# EAGLE design FoamBot Arduino Pololu servo r1 (EAGLE 6.5.0)
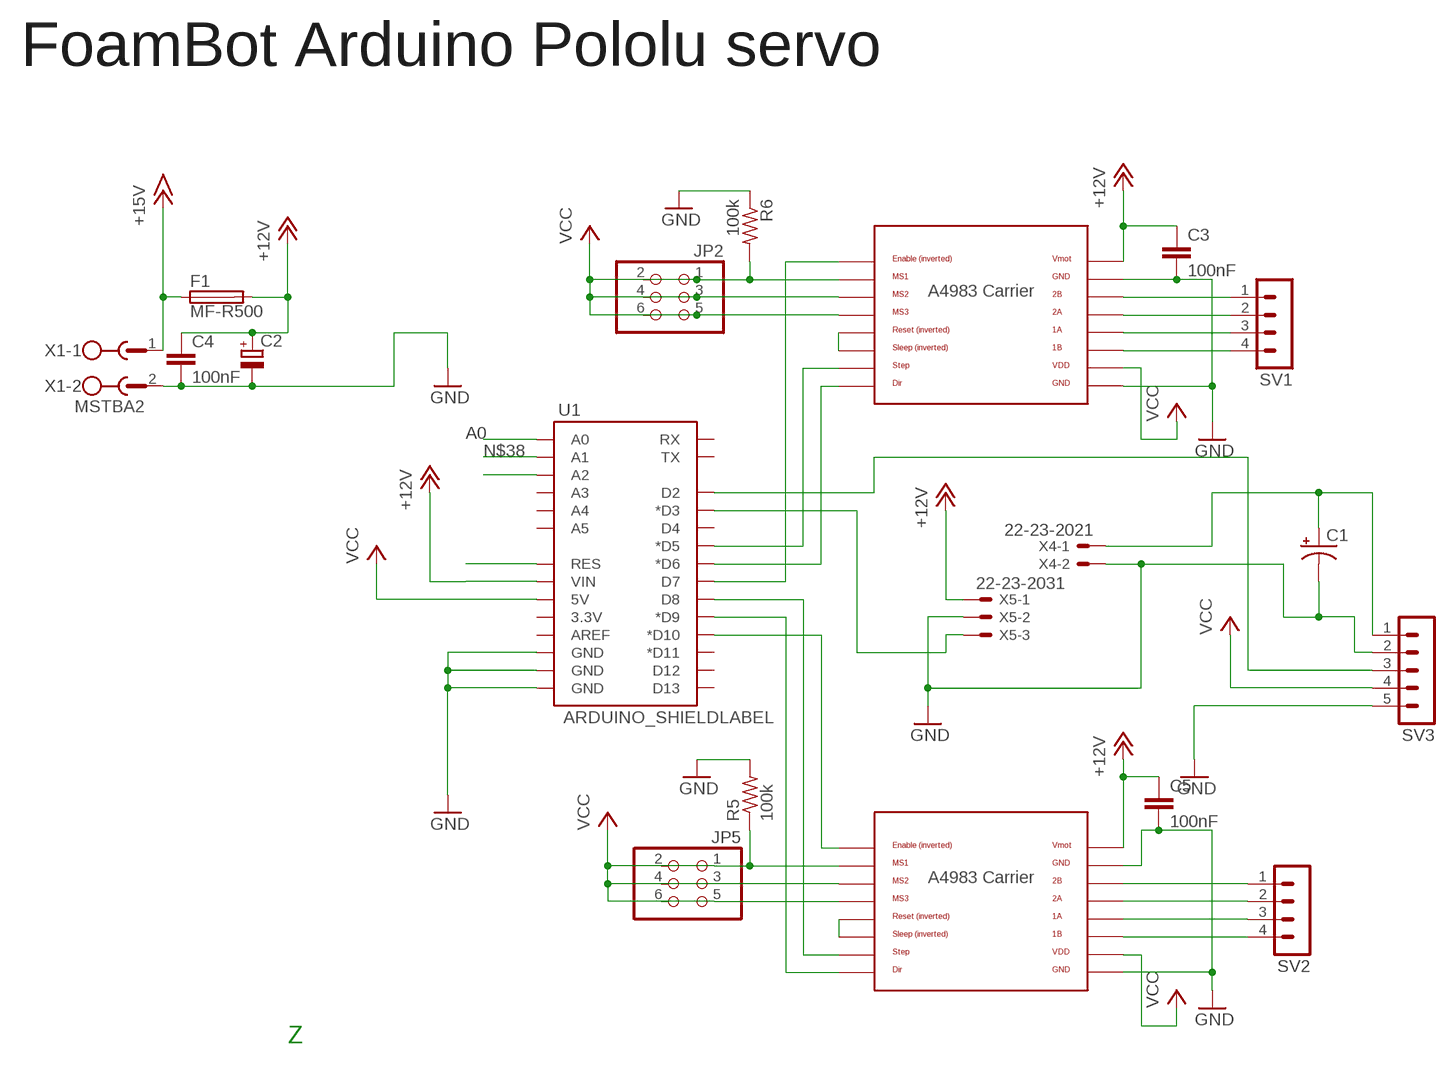
[diagram p0: schematic, sheet 1]

## Parts
C1  CPOL-USE5-10.5  [E5-10,5]
C2  CPOL-EUE7.5-16  [E7,5-16]
C3  100nF  C2,5-3  [C2.5-3]
C4  100nF  C2,5-3  [C2.5-3]
C5  100nF  C2,5-3  [C2.5-3]
F1  MF-R500  LITTLEFUSE  [LITTLEFUSE]
JP2  PINHD-2X3  [2X03]
JP5  PINHD-2X3  [2X03]
R5  100k  R-US_0207/7  [0207/7]
R6  100k  R-US_0207/7  [0207/7]
SV1  MA04-1  [MA04-1]
SV2  MA04-1  [MA04-1]
SV3  MA05-1  [MA05-1]
U1  ARDUINO_SHIELDLABEL  [DUEMILANOVE_SHIELD]
U2  POLOLU_A4983CARRIER  [A4983CARRIER]
U3  POLOLU_A4983CARRIER  [A4983CARRIER]
X1  MSTBA2  [MSTBA2]
X4  22-23-2021  [22-23-2021]
X5  22-23-2031  [22-23-2031]

## Nets
+12V: C2.+ C3.1 C4.1 C5.1 F1.2 U1.VIN U2.VMOT U3.VMOT X5.1
+15V: F1.1 X1.1
A0: U1.A0
GND: C1.- C2.- C3.2 C4.2 C5.2 R5.2 R6.1 SV3.2 SV3.5 U1.GND@0(GND) U1.GND@1(GND) U1.GND@2(GND) U2.GND U2.GND@0(GND) U3.GND U3.GND@0(GND) X1.2 X4.2 X5.2
N$1: U1.D5(*D5) U2.STEP
N$2: U1.D6(*D6) U2.DIR
N$3: SV1.1 U2.2B
N$4: SV1.2 U2.2A
N$8: U2.RST U2.SLP(SLEEP)
N$10: SV1.3 U2.1A
N$11: SV1.4 U2.1B
N$12: SV2.4 U3.1B
N$13: U1.D7 U2.EN
N$16: U1.D8 U3.STEP
N$17: U1.D9(*D9) U3.DIR
N$20: U3.RST U3.SLP(SLEEP)
N$21: SV2.1 U3.2B
N$22: SV2.2 U3.2A
N$23: U1.D10(*D10) U3.EN
N$24: U1.D3(*D3) X5.3
N$25: SV3.3 U1.D2
N$26: SV2.3 U3.1A
N$28: C1.+ SV3.1 X4.1
N$38: U1.A1
N$39: U1.A2
RESET: U1.RES
VCC: JP2.1 JP2.2 JP2.3 JP2.4 JP2.5 JP2.6 JP5.1 JP5.2 JP5.3 JP5.4 JP5.5 JP5.6 R5.1 R6.2 SV3.4 U1.5V U2.MS1 U2.MS2 U2.MS3 U2.VDD U3.MS1 U3.MS2 U3.MS3 U3.VDD
Unconnected: U1.3.3V U1.A3 U1.A4 U1.A5 U1.AREF U1.D4 U1.D11(*D11) U1.D12 U1.D13 U1.RX U1.TX

## Notes on the sheet
- FoamBot Arduino Pololu servo
- Z

## Library data of the parts
C1 = resistor:CPOL-US: POLARIZED CAPACITOR, American symbol
C2 = rcl:CPOL-EU: POLARIZED CAPACITOR, European symbol
C3-C5 = capacitor-wima:C: CAPACITOR naming: grid - package width
F1 = fuse:LITTLEFUSE: LITTLEFUSE Picofuse/slow Littlefuse; OC_FARNELL: unknown; OC_NEWARK: unknown
JP2 JP5 = pinhead:PINHD-2X3: PIN HEADER
R5 R6 = adafruit:R-US_: RESISTOR, American symbol
SV1 SV2 = con-lstb:MA04-1: PIN HEADER; OC_FARNELL: unknown; OC_NEWARK: unknown
SV3 = con-lstb:MA05-1: PIN HEADER; OC_FARNELL: unknown; OC_NEWARK: unknown
U1 = SparkFun-Boards:ARDUINO_SHIELD: Arduino shield footprint
U2 U3 = ultimachine:POLOLU_A4983CARRIER
X1 = con-phoenix-508:MSTBA2: PHOENIX; MF: FARNELL; MPN: 1757242; OC_FARNELL: 3705171; OC_NEWARK: 71C4161
X4 = con-molex:22-23-2021: .100" (2.54mm) Center Header - 2 Pin; MF: MOLEX; MPN: 22-23-2021; OC_FARNELL: 1462926; OC_NEWARK: 25C3832
X5 = con-molex:22-23-2031: .100" (2.54mm) Center Header - 3 Pin; MF: MOLEX; MPN: 22-23-2031; OC_FARNELL: 1462950; OC_NEWARK: 30C0862

## Board
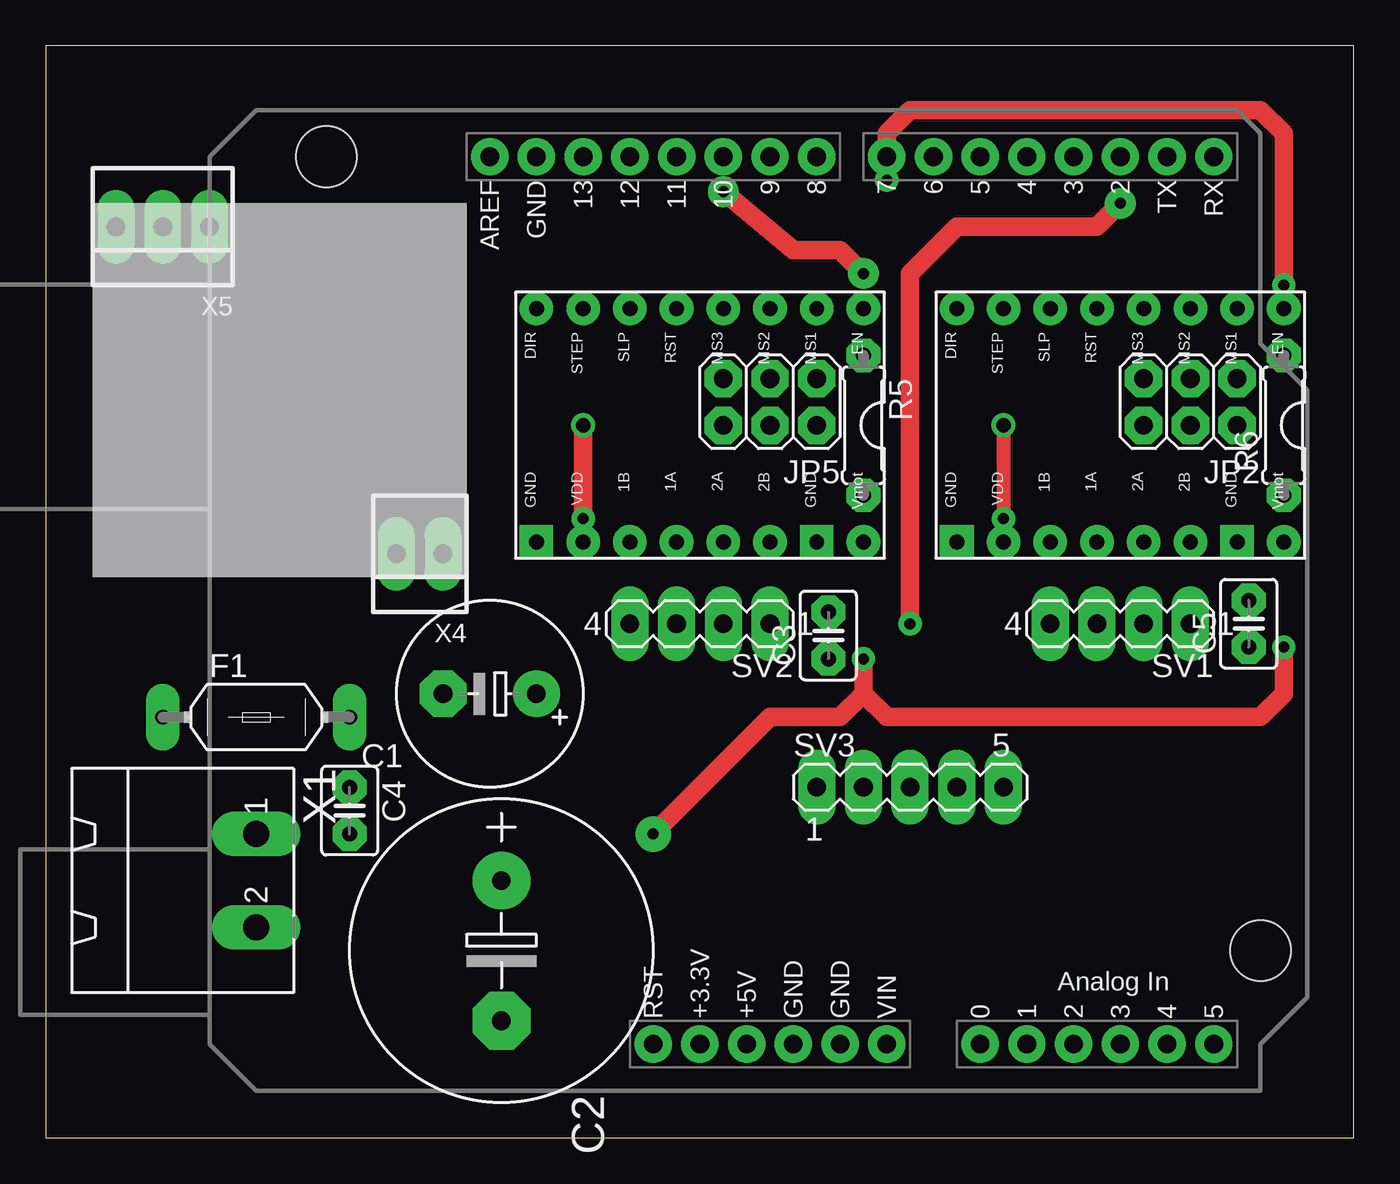
[diagram p1: board, top side]
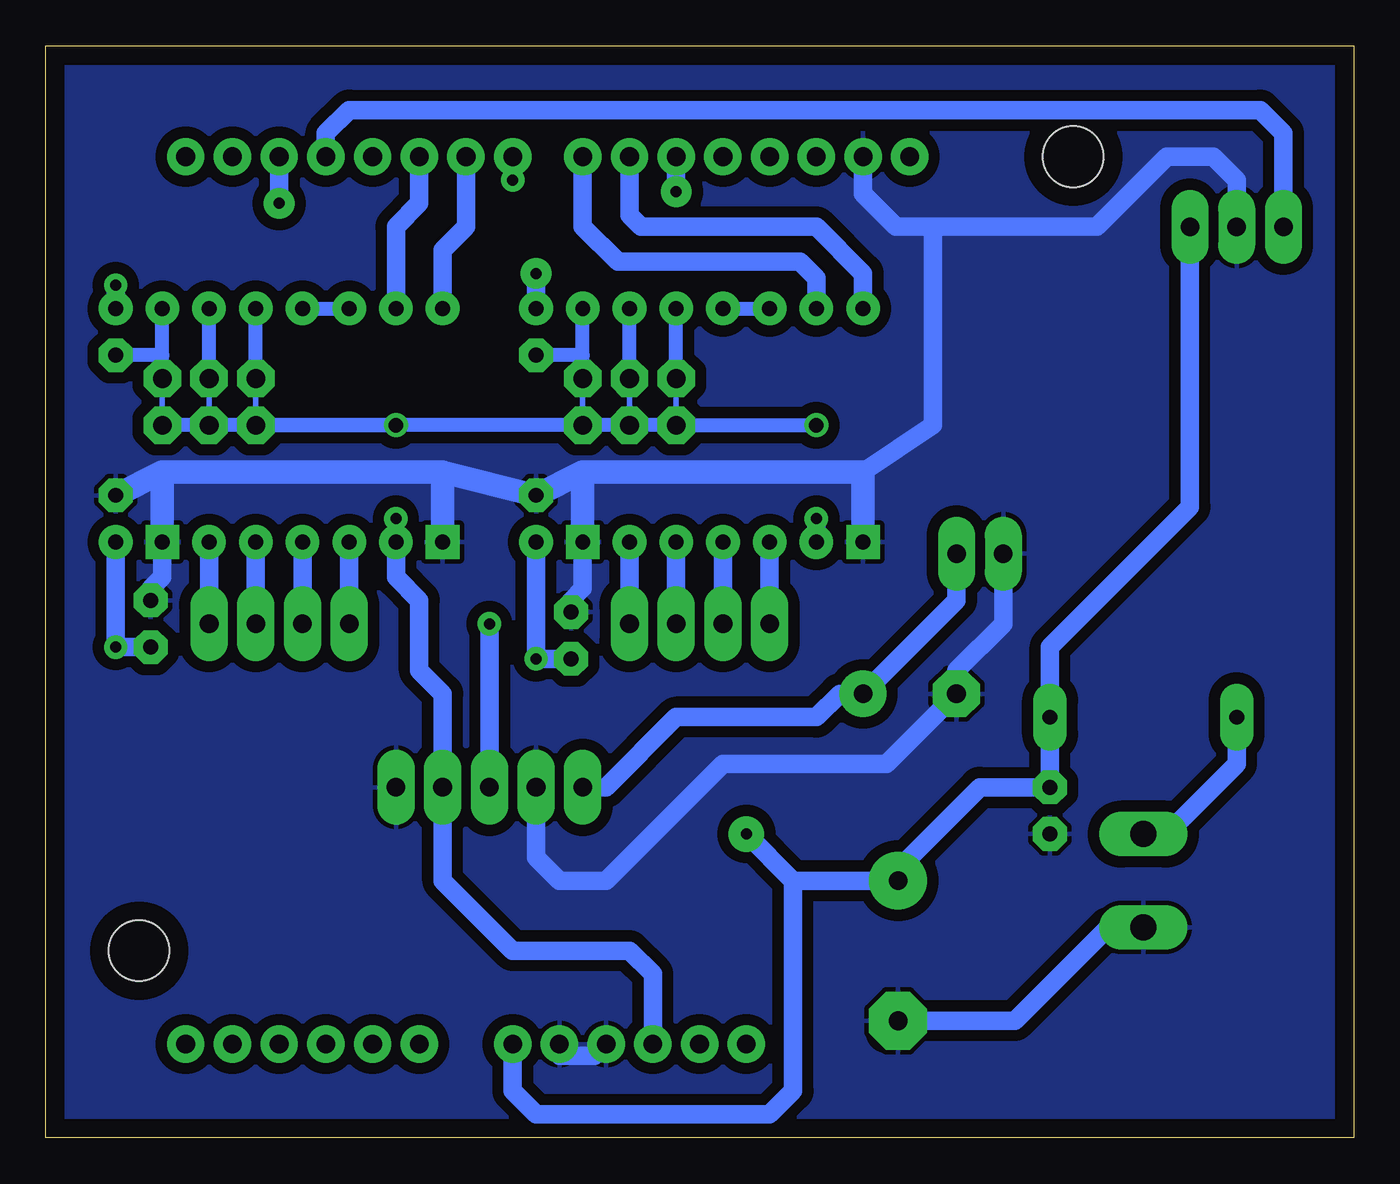
[diagram p2: board, bottom side, seen from below]

Size 71.1 x 59.36 mm. Coordinates in mm from the lower left corner, seen from the top.
Outline: 0,0 71.1,0 71.1,59.36 0,59.36 0,0
Copper layers (1*16): Top 0.035mm / dielectric 1.5mm / Bottom 0.035mm
Design rules "default *": minimum track width 30mil, minimum drill 30mil, track to track 8mil, track to pad 8mil, pad to pad 8mil, via to via 8mil, smd to smd 8mil, copper to edge 40mil, drill to drill 8mil, minimum pad ring 20mil, minimum via ring 10mil, stop-mask expansion 4mil, vias tented up to drill 0mil, thermal gap 10mil

### Footprints (pad centres in the part's own frame; a part is rotated, then mirrored left to right if it is on the bottom)
E5-10,5 = drill 1.016 pad 2.54: + -2.54,0 | drill 1.016 pad 2.54 octagon: - 2.54,0
E7,5-16 = drill 1.016 pad 3.15: + -3.81,0 | drill 1.016 pad 3.15 octagon: - 3.81,0
C2.5-3 = drill 0.813 pad 1.6 octagon: 1 -1.27,0; 2 1.27,0
LITTLEFUSE = drill 0.813 pad 1.778 long: 1 -5.08,0; 2 5.08,0
2X03 = drill 1.016 octagon: 1 -2.54,-1.27; 2 -2.54,1.27; 3 0,-1.27; 4 0,1.27; 5 2.54,-1.27; 6 2.54,1.27
0207/7 = drill 0.813 octagon: 1 -3.81,0; 2 3.81,0
MA04-1 = drill 1.016 long: 1 -3.81,0; 2 -1.27,0; 3 1.27,0; 4 3.81,0
MA05-1 = drill 1.016 long: 1 -5.08,0; 2 -2.54,0; 3 0,0; 4 2.54,0; 5 5.08,0
DUEMILANOVE_SHIELD = drill 1.016 pad 1.88: 3.3V 50.8,26.67; 5V 50.8,29.21; A0 50.8,41.91; A1 50.8,44.45; A2 50.8,46.99; A3 50.8,49.53; A4 50.8,52.07; A5 50.8,54.61; AREF 2.54,15.24; D2 2.54,49.53; D3 2.54,46.99; D4 2.54,44.45; D5 2.54,41.91; D6 2.54,39.37; D7 2.54,36.83; D8 2.54,33.02; D9 2.54,30.48; D10 2.54,27.94; D11 2.54,25.4; D12 2.54,22.86; D13 2.54,20.32; GND@0 50.8,31.75; GND@1 50.8,34.29; GND@2 2.54,17.78; RES 50.8,24.13; RX 2.54,54.61; TX 2.54,52.07; VIN 50.8,36.83 | hole 3.302: 45.72,57.15; 2.54,6.35
A4983CARRIER = drill 0.813: 1A 8.89,1.27; 1B 11.43,1.27; 2A 6.35,1.27; 2B 3.81,1.27; DIR 16.51,-11.43; EN -1.27,-11.43; MS1 1.27,-11.43; MS2 3.81,-11.43; MS3 6.35,-11.43; RST 8.89,-11.43; SLP 11.43,-11.43; STEP 13.97,-11.43; VDD 13.97,1.27; VMOT -1.27,1.27 | drill 0.813 square: GND 16.51,1.27; GND@0 1.27,1.27
MSTBA2 = drill 1.397 long: 1 -2.54,5.08; 2 2.54,5.08
22-23-2021 = drill 1 long: 1 -1.27,0; 2 1.27,0
22-23-2031 = drill 1 long: 1 -2.54,0; 2 0,0; 3 2.54,0

### Placement (x,y rotation side)
C1  24.13,24.13 180 top
C2  24.77,10.16 270 top
C3  42.55,27.3 90 top
C4  16.51,17.78 270 top
C5  65.41,27.94 90 top
F1  11.43,22.86 0 top
JP2  62.23,40.01 180 top
JP5  39.37,40.01 180 top
R5  44.45,38.73 270 top
R6  67.31,38.73 90 top
SV1  58.42,27.94 180 top
SV2  35.56,27.94 180 top
SV3  46.99,19.05 0 top
U1  8.89,55.88 270 top
U2  66.04,33.66 180 top
U3  43.18,33.66 180 top
X1  6.35,13.97 270 top
X4  20.32,31.75 180 top
X5  6.35,49.53 180 top

### Tracks (layer width: path | path; a pad name or v marks a point on that pad's centre or on a via)
+12V  (via drill 0.6 pad 1.27, 0.6 pad 1.93)
  Top 1.016: v67.31,26.67 67.31,24.13 66.04,22.86 45.72,22.86 44.45,24.13 | 44.45,24.13 v44.45,26.04 | v33.02,16.51 39.37,22.86 43.18,22.86 44.45,24.13
  Bottom 1.016: U2.VMOT v67.31,26.67 C5.1 | U3.VMOT v44.45,26.04 C3.1 | 25.4,13.97 30.48,13.97 | 30.48,13.97 v33.02,16.51 | U1.VIN 45.72,2.54 44.45,1.27 31.75,1.27 30.48,2.54 30.48,13.97 | C2.+ 25.4,13.97 | 25.4,13.97 20.32,19.05 C4.1 F1.2 16.51,26.67 8.89,34.29 X5.1
+15V
  Bottom 1.016: X1.1 10.16,16.51 6.35,20.32 F1.1
GND
  Bottom 1.016: X5.2 6.35,52.07 7.62,53.34 10.16,53.34 13.97,49.53 22.86,49.53 | U1.GND@2 26.67,51.33 24.87,49.53 22.86,49.53 | 22.86,49.53 22.86,38.73 26.67,36.2 | X4.2 19.05,27.94 21.59,25.4 C1.- 25.4,20.32 34.29,20.32 40.64,13.97 43.18,13.97 44.45,15.24 SV3.2 | C5.2 65.41,29.84 64.77,30.48 U2.GND@0 | C3.2 42.55,29.21 41.91,29.84 U3.GND@0 | 43.18,4.45 41.27,4.45 U1.GND@0
  Bottom 1.27: 41.91,36.2 R5.2 49.53,36.2 | 64.77,36.2 U2.GND@0 | R6.1 64.77,36.2 | 49.53,36.2 U2.GND | 64.77,36.2 49.53,36.2 | U3.GND 26.67,36.2 41.91,36.2 | 41.91,36.2 U3.GND@0
  pour Bottom (isolate 0.61): 0,0 71.12,0 71.12,58.42 0,58.42
N$1
  Bottom 1.016: U1.D5 50.8,50.8 52.07,49.53 U2.STEP
N$2
  Bottom 1.016: U1.D6 48.26,49.53 49.53,48.26 U2.DIR
N$3
  Bottom 1.016: U2.2B SV1.1
N$4
  Bottom 1.016: U2.2A SV1.2
N$5
  Bottom 1.016: 10.79,11.43 13.34,11.43 18.41,6.35 24.77,6.35 25.4,5.71
N$7  (via drill 0.6 pad 1.27)
  other vias: 52.07,33.66
N$8
  Bottom 0.762: U2.RST U2.SLP
N$10
  Bottom 1.016: U2.1A SV1.3
N$11
  Bottom 1.016: U2.1B SV1.4
N$12
  Bottom 1.016: U3.1B SV2.4
N$13  (via drill 0.6 pad 1.27)
  Top 1.016: v67.31,46.35 67.31,54.61 66.04,55.88 46.99,55.88 45.72,54.61 v45.72,52.07
  Bottom 1.016: U2.EN v67.31,46.35 | U1.D7 v45.72,52.07
N$16
  Bottom 1.016: U1.D8 41.91,49.53 40.01,47.62 30.11,47.62 29.21,46.73 U3.STEP
N$17
  Bottom 1.016: U1.D9 39.37,50.16 38.73,49.53 29.21,49.53 26.67,46.99 U3.DIR
N$20
  Bottom 0.762: U3.RST U3.SLP
N$21
  Bottom 1.016: U3.2B SV2.1
N$22
  Bottom 1.016: U3.2A SV2.2
N$23  (via drill 0.6 pad 1.68)
  Top 1.016: v44.45,46.99 43.18,48.26 40.64,48.26 v36.83,51.44
  Bottom 1.016: U3.EN v44.45,46.99 | v36.83,51.44 U1.D10
N$24
  Bottom 1.016: U1.D3 55.88,54.61 54.61,55.88 5.08,55.88 3.81,54.61 X5.3
N$25  (via drill 0.6 pad 1.27, 0.6 pad 1.68)
  Top 1.016: v58.42,50.8 57.15,49.53 49.53,49.53 46.99,46.99 v46.99,27.94
  Bottom 1.016: U1.D2 v58.42,50.8 | v46.99,27.94 SV3.3
N$26
  Bottom 1.016: U3.1A SV2.3
N$28
  Bottom 1.016: X4.1 21.59,29.21 C1.+ 27.94,24.13 29.21,22.86 36.83,22.86 40.64,19.05 SV3.1
VCC  (via drill 0.6 pad 1.27, 0.8, 0.8 pad 1.27)
  Top 0.762: v52.07,38.73 U2.VDD
  Top 1.016: v29.21,33.66 v29.21,38.73
  Bottom 0.305: U2.MS3 JP2.6 | U2.MS2 JP2.4 | JP2.1 JP2.2 | JP5.2 JP5.1 | U3.MS3 JP5.6 | JP5.3 JP5.4
  Bottom 0.762: JP2.6 v52.07,38.73 | JP2.6 JP2.4 JP2.2 | v29.21,38.73 JP5.6 JP5.4 JP5.2 JP2.6 | JP2.5 U2.MS3 | JP2.3 U2.MS2 | JP2.1 64.77,42.55 | 64.77,42.55 U2.MS1 | 64.77,42.55 R6.2 | JP5.1 41.91,42.55 | 41.91,42.55 U3.MS1 | 41.91,42.55 R5.1 | JP5.3 U3.MS2 | JP5.5 U3.MS3
  Bottom 1.016: U1.5V 38.1,8.89 39.37,10.16 45.72,10.16 49.53,13.97 SV3.4 49.53,24.13 50.8,25.4 50.8,29.21 52.07,30.48 U2.VDD | U3.VDD v29.21,33.66